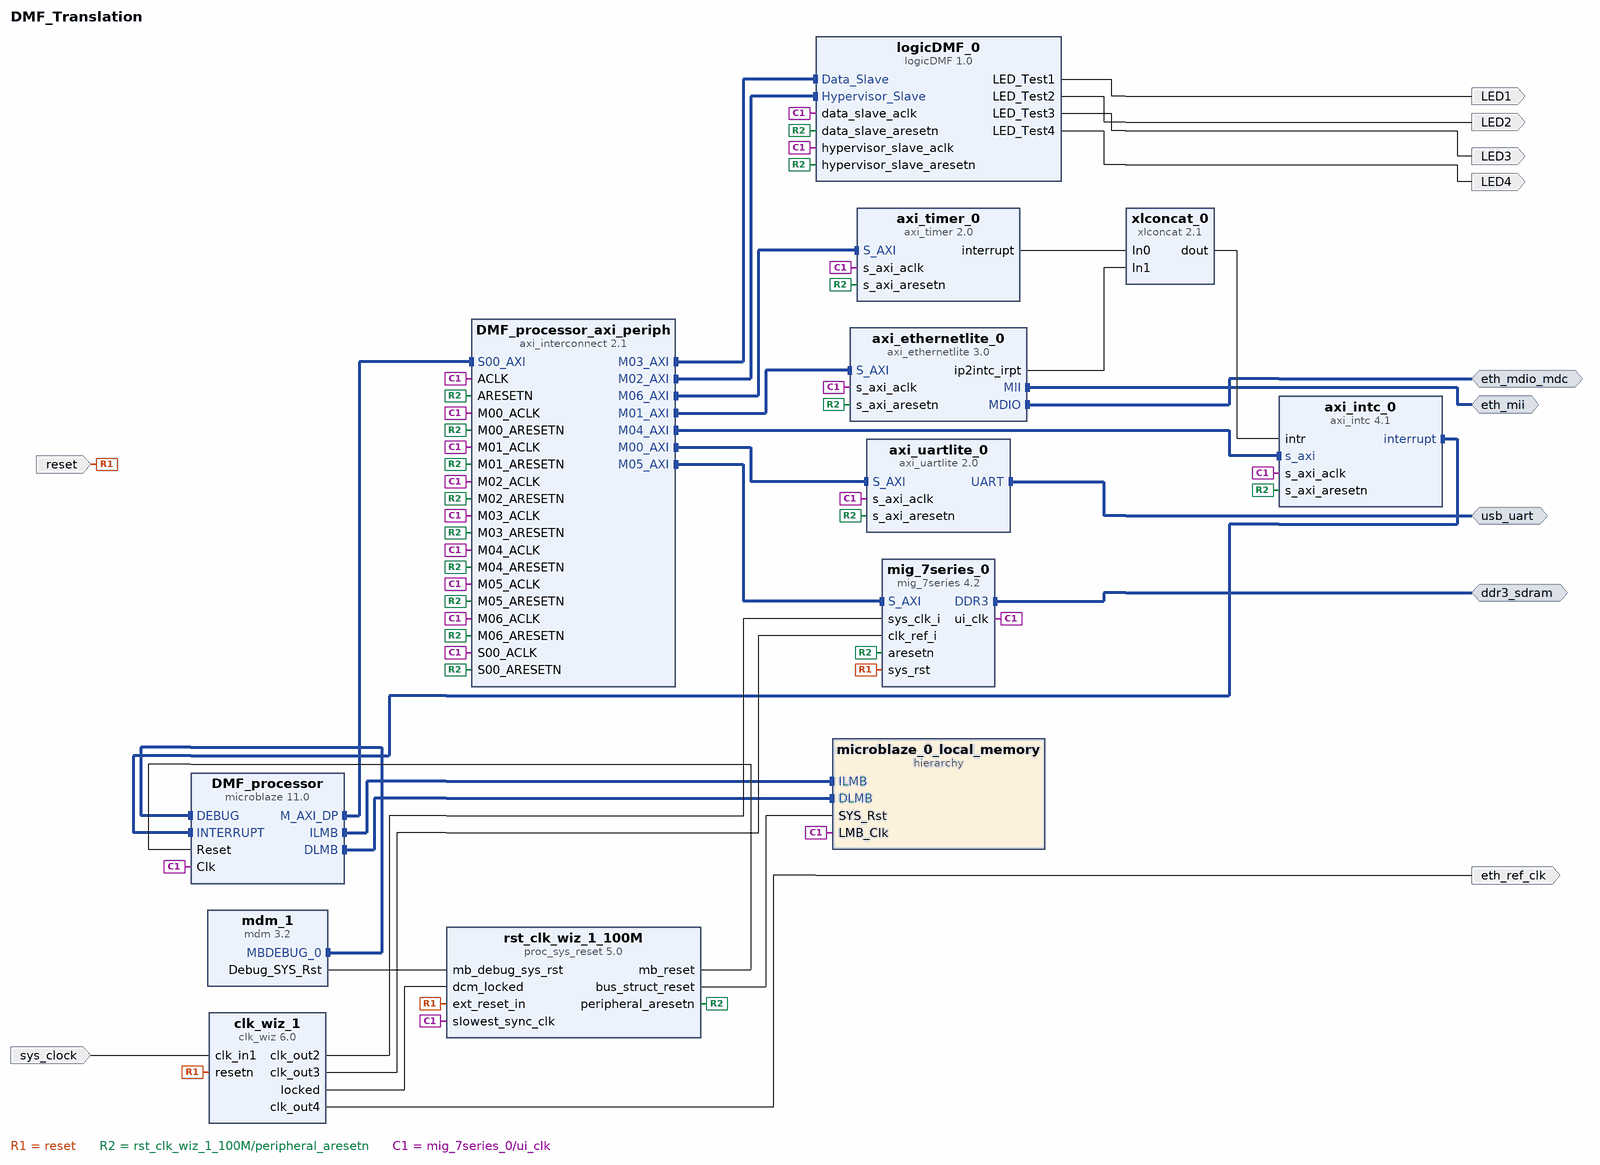
[diagram p0: block diagram of the top level]
# Vivado block design DMF_Translation, xc7a35ticsg324-1L, Vivado 2019.1
create_bd_design DMF_Translation

create_bd_intf_port -mode Master -vlnv xilinx.com:interface:uart_rtl:1.0 usb_uart
create_bd_intf_port -mode Master -vlnv xilinx.com:interface:mii_rtl:1.0 eth_mii
create_bd_intf_port -mode Master -vlnv xilinx.com:interface:mdio_rtl:1.0 eth_mdio_mdc
create_bd_intf_port -mode Master -vlnv xilinx.com:interface:ddrx_rtl:1.0 ddr3_sdram
create_bd_port -dir I -type rst reset
set_property -dict {CONFIG.POLARITY ACTIVE_LOW} [get_bd_ports reset]
create_bd_port -dir I -type clk sys_clock
set_property -dict {CONFIG.FREQ_HZ 100000000 CONFIG.PHASE 0.000} [get_bd_ports sys_clock]
create_bd_port -dir O -type clk eth_ref_clk
create_bd_port -dir O LED1
create_bd_port -dir O LED2
create_bd_port -dir O LED3
create_bd_port -dir O LED4

create_bd_cell -type ip -vlnv xilinx.com:ip:microblaze:11.0 DMF_processor
set_property -dict {CONFIG.C_DEBUG_ENABLED 1 CONFIG.C_D_AXI 1 CONFIG.C_D_LMB 1 CONFIG.C_I_LMB 1} [get_bd_cells DMF_processor]
create_bd_cell -type hier microblaze_0_local_memory
create_bd_cell -type ip -vlnv xilinx.com:ip:mdm:3.2 mdm_1
create_bd_cell -type ip -vlnv xilinx.com:ip:clk_wiz:6.0 clk_wiz_1
set_property -dict [list \
  CONFIG.CLKOUT2_JITTER 118.758 \
  CONFIG.CLKOUT2_PHASE_ERROR 98.575 \
  CONFIG.CLKOUT2_REQUESTED_OUT_FREQ 166.667 \
  CONFIG.CLKOUT2_USED true \
  CONFIG.CLKOUT3_JITTER 114.829 \
  CONFIG.CLKOUT3_PHASE_ERROR 98.575 \
  CONFIG.CLKOUT3_REQUESTED_OUT_FREQ 200.000 \
  CONFIG.CLKOUT3_USED true \
  CONFIG.CLKOUT4_JITTER 175.402 \
  CONFIG.CLKOUT4_PHASE_ERROR 98.575 \
  CONFIG.CLKOUT4_REQUESTED_OUT_FREQ 25.000 \
  CONFIG.CLKOUT4_USED true \
  CONFIG.CLK_IN1_BOARD_INTERFACE sys_clock \
  CONFIG.MMCM_CLKOUT1_DIVIDE 6 \
  CONFIG.MMCM_CLKOUT2_DIVIDE 5 \
  CONFIG.MMCM_CLKOUT3_DIVIDE 40 \
  CONFIG.NUM_OUT_CLKS 4 \
  CONFIG.PRIM_SOURCE Single_ended_clock_capable_pin \
  CONFIG.RESET_BOARD_INTERFACE reset \
  CONFIG.RESET_PORT resetn \
  CONFIG.RESET_TYPE ACTIVE_LOW \
  CONFIG.USE_BOARD_FLOW true \
] [get_bd_cells clk_wiz_1]
create_bd_cell -type ip -vlnv xilinx.com:ip:proc_sys_reset:5.0 rst_clk_wiz_1_100M
set_property -dict {CONFIG.RESET_BOARD_INTERFACE reset CONFIG.USE_BOARD_FLOW true} [get_bd_cells rst_clk_wiz_1_100M]
create_bd_cell -type ip -vlnv xilinx.com:ip:axi_uartlite:2.0 axi_uartlite_0
set_property -dict {CONFIG.UARTLITE_BOARD_INTERFACE usb_uart CONFIG.USE_BOARD_FLOW true} [get_bd_cells axi_uartlite_0]
create_bd_cell -type ip -vlnv xilinx.com:ip:axi_ethernetlite:3.0 axi_ethernetlite_0
set_property -dict [list \
  CONFIG.MDIO_BOARD_INTERFACE eth_mdio_mdc \
  CONFIG.MII_BOARD_INTERFACE eth_mii \
  CONFIG.USE_BOARD_FLOW true \
] [get_bd_cells axi_ethernetlite_0]
create_bd_cell -type ip -vlnv xilinx.com:user:logicDMF:1.0 logicDMF_0
create_bd_cell -type ip -vlnv xilinx.com:ip:axi_interconnect:2.1 DMF_processor_axi_periph
set_property -dict {CONFIG.NUM_MI 7} [get_bd_cells DMF_processor_axi_periph]
create_bd_cell -type ip -vlnv xilinx.com:ip:axi_intc:4.1 axi_intc_0
create_bd_cell -type ip -vlnv xilinx.com:ip:mig_7series:4.2 mig_7series_0
set_property -dict {CONFIG.BOARD_MIG_PARAM ddr3_sdram CONFIG.RESET_BOARD_INTERFACE reset} [get_bd_cells mig_7series_0]
create_bd_cell -type ip -vlnv xilinx.com:ip:axi_timer:2.0 axi_timer_0
create_bd_cell -type ip -vlnv xilinx.com:ip:xlconcat:2.1 xlconcat_0

# ---- hierarchy /microblaze_0_local_memory ----
current_bd_instance /microblaze_0_local_memory
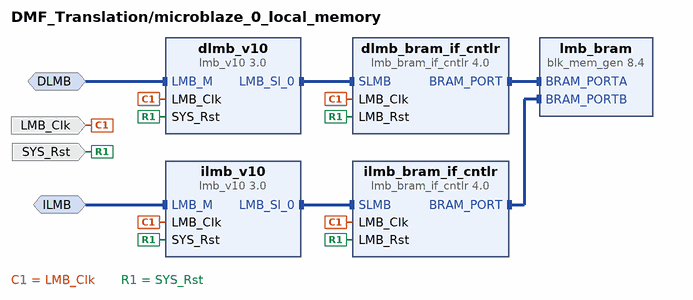
[diagram p1: block diagram inside /microblaze_0_local_memory]
create_bd_intf_pin -mode MirroredMaster -vlnv xilinx.com:interface:lmb_rtl:1.0 DLMB
create_bd_intf_pin -mode MirroredMaster -vlnv xilinx.com:interface:lmb_rtl:1.0 ILMB
create_bd_pin -dir I -type clk LMB_Clk
create_bd_pin -dir I -type rst SYS_Rst

create_bd_cell -type ip -vlnv xilinx.com:ip:lmb_v10:3.0 dlmb_v10
create_bd_cell -type ip -vlnv xilinx.com:ip:lmb_v10:3.0 ilmb_v10
create_bd_cell -type ip -vlnv xilinx.com:ip:lmb_bram_if_cntlr:4.0 dlmb_bram_if_cntlr
set_property -dict {CONFIG.C_ECC 0} [get_bd_cells dlmb_bram_if_cntlr]
create_bd_cell -type ip -vlnv xilinx.com:ip:lmb_bram_if_cntlr:4.0 ilmb_bram_if_cntlr
set_property -dict {CONFIG.C_ECC 0} [get_bd_cells ilmb_bram_if_cntlr]
create_bd_cell -type ip -vlnv xilinx.com:ip:blk_mem_gen:8.4 lmb_bram
set_property -dict {CONFIG.Memory_Type True_Dual_Port_RAM CONFIG.use_bram_block BRAM_Controller} [get_bd_cells lmb_bram]

# ---- connections ----

current_bd_instance /microblaze_0_local_memory
connect_bd_intf_net -intf_net microblaze_0_dlmb_cntlr [get_bd_intf_pins dlmb_bram_if_cntlr/BRAM_PORT] [get_bd_intf_pins lmb_bram/BRAM_PORTA]
connect_bd_intf_net -intf_net microblaze_0_dlmb [get_bd_intf_pins DLMB] [get_bd_intf_pins dlmb_v10/LMB_M]
connect_bd_intf_net -intf_net microblaze_0_ilmb [get_bd_intf_pins ILMB] [get_bd_intf_pins ilmb_v10/LMB_M]
connect_bd_intf_net -intf_net microblaze_0_ilmb_cntlr [get_bd_intf_pins ilmb_bram_if_cntlr/BRAM_PORT] [get_bd_intf_pins lmb_bram/BRAM_PORTB]
connect_bd_intf_net -intf_net microblaze_0_dlmb_bus [get_bd_intf_pins dlmb_v10/LMB_Sl_0] [get_bd_intf_pins dlmb_bram_if_cntlr/SLMB]
connect_bd_intf_net -intf_net microblaze_0_ilmb_bus [get_bd_intf_pins ilmb_v10/LMB_Sl_0] [get_bd_intf_pins ilmb_bram_if_cntlr/SLMB]
connect_bd_net -net microblaze_0_Clk [get_bd_pins LMB_Clk] \
  [get_bd_pins dlmb_v10/LMB_Clk] [get_bd_pins dlmb_bram_if_cntlr/LMB_Clk] [get_bd_pins ilmb_v10/LMB_Clk] \
  [get_bd_pins ilmb_bram_if_cntlr/LMB_Clk]
connect_bd_net [get_bd_pins SYS_Rst] \
  [get_bd_pins dlmb_v10/SYS_Rst] [get_bd_pins dlmb_bram_if_cntlr/LMB_Rst] [get_bd_pins ilmb_v10/SYS_Rst] \
  [get_bd_pins ilmb_bram_if_cntlr/LMB_Rst]
set_property HDL_ATTRIBUTE.BMM_INFO_ADDRESS_SPACE {byte  0x00000000 32 > DMF_Translation microblaze_0_local_memory/lmb_bram} [get_bd_cells dlmb_bram_if_cntlr]
set_property HDL_ATTRIBUTE.KEEP_HIERARCHY yes [get_bd_cells dlmb_bram_if_cntlr]

current_bd_instance /
connect_bd_intf_net [get_bd_intf_ports eth_mii] [get_bd_intf_pins axi_ethernetlite_0/MII]
connect_bd_intf_net [get_bd_intf_ports eth_mdio_mdc] [get_bd_intf_pins axi_ethernetlite_0/MDIO]
connect_bd_intf_net [get_bd_intf_ports usb_uart] [get_bd_intf_pins axi_uartlite_0/UART]
connect_bd_intf_net [get_bd_intf_pins DMF_processor/M_AXI_DP] [get_bd_intf_pins DMF_processor_axi_periph/S00_AXI]
connect_bd_intf_net [get_bd_intf_pins DMF_processor_axi_periph/M00_AXI] [get_bd_intf_pins axi_uartlite_0/S_AXI]
connect_bd_intf_net [get_bd_intf_pins DMF_processor_axi_periph/M01_AXI] [get_bd_intf_pins axi_ethernetlite_0/S_AXI]
connect_bd_intf_net [get_bd_intf_pins DMF_processor_axi_periph/M04_AXI] [get_bd_intf_pins axi_intc_0/s_axi]
connect_bd_intf_net -intf_net microblaze_0_ilmb_1 [get_bd_intf_pins DMF_processor/ILMB] [get_bd_intf_pins microblaze_0_local_memory/ILMB]
connect_bd_intf_net [get_bd_intf_pins DMF_processor_axi_periph/M03_AXI] [get_bd_intf_pins logicDMF_0/Data_Slave]
connect_bd_intf_net [get_bd_intf_pins DMF_processor_axi_periph/M06_AXI] [get_bd_intf_pins axi_timer_0/S_AXI]
connect_bd_intf_net -intf_net microblaze_0_dlmb_1 [get_bd_intf_pins DMF_processor/DLMB] [get_bd_intf_pins microblaze_0_local_memory/DLMB]
connect_bd_intf_net [get_bd_intf_pins axi_intc_0/interrupt] [get_bd_intf_pins DMF_processor/INTERRUPT]
connect_bd_intf_net [get_bd_intf_pins DMF_processor_axi_periph/M02_AXI] [get_bd_intf_pins logicDMF_0/Hypervisor_Slave]
connect_bd_intf_net -intf_net microblaze_0_debug [get_bd_intf_pins mdm_1/MBDEBUG_0] [get_bd_intf_pins DMF_processor/DEBUG]
connect_bd_intf_net [get_bd_intf_ports ddr3_sdram] [get_bd_intf_pins mig_7series_0/DDR3]
connect_bd_intf_net [get_bd_intf_pins DMF_processor_axi_periph/M05_AXI] [get_bd_intf_pins mig_7series_0/S_AXI]
connect_bd_net [get_bd_pins clk_wiz_1/locked] [get_bd_pins rst_clk_wiz_1_100M/dcm_locked]
connect_bd_net [get_bd_pins rst_clk_wiz_1_100M/mb_reset] [get_bd_pins DMF_processor/Reset]
connect_bd_net [get_bd_pins rst_clk_wiz_1_100M/bus_struct_reset] [get_bd_pins microblaze_0_local_memory/SYS_Rst]
connect_bd_net [get_bd_pins mdm_1/Debug_SYS_Rst] [get_bd_pins rst_clk_wiz_1_100M/mb_debug_sys_rst]
connect_bd_net [get_bd_ports reset] [get_bd_pins rst_clk_wiz_1_100M/ext_reset_in] [get_bd_pins clk_wiz_1/resetn] [get_bd_pins mig_7series_0/sys_rst]
connect_bd_net [get_bd_pins rst_clk_wiz_1_100M/peripheral_aresetn] \
  [get_bd_pins DMF_processor_axi_periph/S00_ARESETN] [get_bd_pins axi_uartlite_0/s_axi_aresetn] \
  [get_bd_pins DMF_processor_axi_periph/M00_ARESETN] [get_bd_pins DMF_processor_axi_periph/ARESETN] \
  [get_bd_pins axi_ethernetlite_0/s_axi_aresetn] [get_bd_pins DMF_processor_axi_periph/M01_ARESETN] \
  [get_bd_pins logicDMF_0/hypervisor_slave_aresetn] [get_bd_pins DMF_processor_axi_periph/M02_ARESETN] \
  [get_bd_pins logicDMF_0/data_slave_aresetn] [get_bd_pins DMF_processor_axi_periph/M03_ARESETN] \
  [get_bd_pins axi_intc_0/s_axi_aresetn] [get_bd_pins DMF_processor_axi_periph/M04_ARESETN] \
  [get_bd_pins mig_7series_0/aresetn] [get_bd_pins DMF_processor_axi_periph/M05_ARESETN] \
  [get_bd_pins axi_timer_0/s_axi_aresetn] [get_bd_pins DMF_processor_axi_periph/M06_ARESETN]
connect_bd_net [get_bd_pins clk_wiz_1/clk_out2] [get_bd_pins mig_7series_0/sys_clk_i]
connect_bd_net [get_bd_pins clk_wiz_1/clk_out3] [get_bd_pins mig_7series_0/clk_ref_i]
connect_bd_net [get_bd_ports sys_clock] [get_bd_pins clk_wiz_1/clk_in1]
connect_bd_net [get_bd_pins mig_7series_0/ui_clk] \
  [get_bd_pins DMF_processor/Clk] [get_bd_pins microblaze_0_local_memory/LMB_Clk] \
  [get_bd_pins DMF_processor_axi_periph/S00_ACLK] [get_bd_pins rst_clk_wiz_1_100M/slowest_sync_clk] \
  [get_bd_pins axi_uartlite_0/s_axi_aclk] [get_bd_pins DMF_processor_axi_periph/M00_ACLK] \
  [get_bd_pins axi_ethernetlite_0/s_axi_aclk] [get_bd_pins DMF_processor_axi_periph/M01_ACLK] \
  [get_bd_pins logicDMF_0/data_slave_aclk] [get_bd_pins DMF_processor_axi_periph/M03_ACLK] \
  [get_bd_pins logicDMF_0/hypervisor_slave_aclk] [get_bd_pins DMF_processor_axi_periph/M02_ACLK] \
  [get_bd_pins DMF_processor_axi_periph/ACLK] [get_bd_pins axi_intc_0/s_axi_aclk] \
  [get_bd_pins DMF_processor_axi_periph/M04_ACLK] [get_bd_pins DMF_processor_axi_periph/M05_ACLK] \
  [get_bd_pins axi_timer_0/s_axi_aclk] [get_bd_pins DMF_processor_axi_periph/M06_ACLK]
connect_bd_net [get_bd_pins xlconcat_0/dout] [get_bd_pins axi_intc_0/intr]
connect_bd_net [get_bd_pins axi_ethernetlite_0/ip2intc_irpt] [get_bd_pins xlconcat_0/In1]
connect_bd_net [get_bd_pins axi_timer_0/interrupt] [get_bd_pins xlconcat_0/In0]
connect_bd_net [get_bd_pins clk_wiz_1/clk_out4] [get_bd_ports eth_ref_clk]
connect_bd_net [get_bd_pins logicDMF_0/LED_Test1] [get_bd_ports LED1]
connect_bd_net [get_bd_pins logicDMF_0/LED_Test2] [get_bd_ports LED2]
connect_bd_net [get_bd_pins logicDMF_0/LED_Test3] [get_bd_ports LED3]
connect_bd_net [get_bd_pins logicDMF_0/LED_Test4] [get_bd_ports LED4]
set_property HDL_ATTRIBUTE.BMM_INFO_PROCESSOR {microblaze-le > DMF_Translation microblaze_0_local_memory/dlmb_bram_if_cntlr} [get_bd_cells DMF_processor]
set_property HDL_ATTRIBUTE.KEEP_HIERARCHY yes [get_bd_cells DMF_processor]

# ---- address map ----
assign_bd_address -offset 0x00000000 -range 32K -target_address_space [get_bd_addr_spaces DMF_processor/Data] [get_bd_addr_segs microblaze_0_local_memory/dlmb_bram_if_cntlr/SLMB/Mem]
assign_bd_address -offset 0x40600000 -range 64K -target_address_space [get_bd_addr_spaces DMF_processor/Data] [get_bd_addr_segs axi_uartlite_0/S_AXI/Reg]
assign_bd_address -offset 0x40E00000 -range 64K -target_address_space [get_bd_addr_spaces DMF_processor/Data] [get_bd_addr_segs axi_ethernetlite_0/S_AXI/Reg]
assign_bd_address -offset 0x41200000 -range 64K -target_address_space [get_bd_addr_spaces DMF_processor/Data] [get_bd_addr_segs axi_intc_0/S_AXI/Reg]
assign_bd_address -offset 0x41C00000 -range 64K -target_address_space [get_bd_addr_spaces DMF_processor/Data] [get_bd_addr_segs axi_timer_0/S_AXI/Reg]
assign_bd_address -offset 0x44A00000 -range 64K -target_address_space [get_bd_addr_spaces DMF_processor/Data] [get_bd_addr_segs logicDMF_0/Hypervisor_Slave/Hypervisor_Slave_reg]
assign_bd_address -offset 0x44A10000 -range 64K -target_address_space [get_bd_addr_spaces DMF_processor/Data] [get_bd_addr_segs logicDMF_0/Data_Slave/Data_Slave_reg]
assign_bd_address -offset 0x80000000 -range 256M -target_address_space [get_bd_addr_spaces DMF_processor/Data] [get_bd_addr_segs mig_7series_0/memmap/memaddr]
assign_bd_address -offset 0x00000000 -range 32K -target_address_space [get_bd_addr_spaces DMF_processor/Instruction] [get_bd_addr_segs microblaze_0_local_memory/ilmb_bram_if_cntlr/SLMB/Mem]

validate_bd_design
save_bd_design
